# Altium schematic sheet Sheet2_datciki.SchDoc
size 420 x 297 mm; Address1: Address1; Address2: Address2; Address3: Address3; Address4: Address4; SheetNumber: 1; Scale: 1:1; Обозначение документа: АБВГ.123456.001 Э3
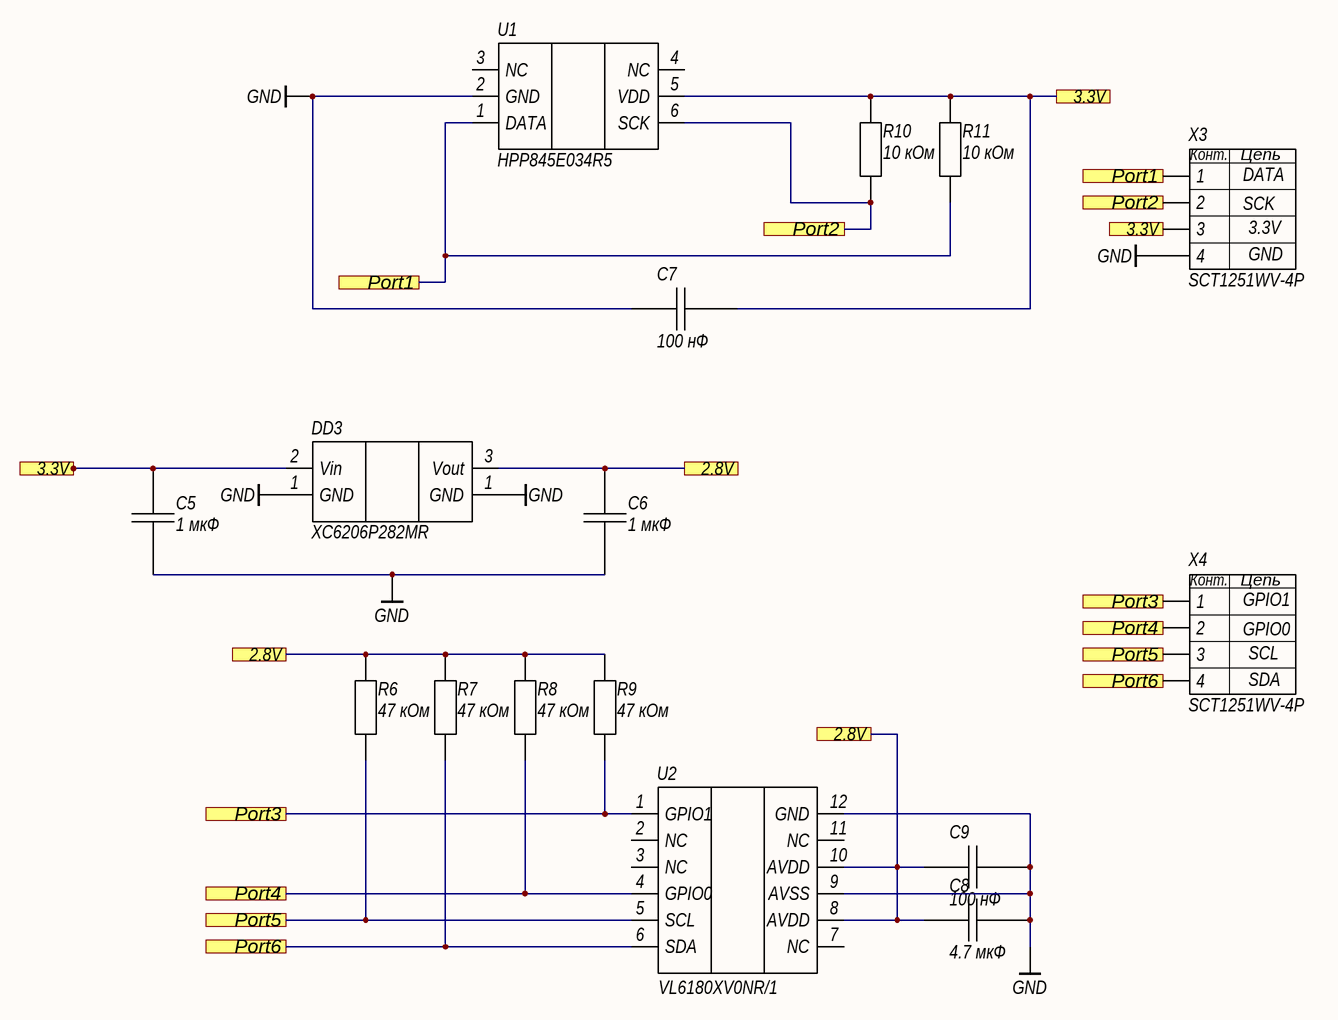
[diagram p0: Sheet2_datciki.SchDoc]

## Parts
C5  1 мкФ  [CAP_0805]
C6  1 мкФ  [CAP_0805]
C7  100 нФ  [CAP_0805]
C8  4.7 мкФ  [CAP_0805]
C9  100 нФ  [CAP_0805]
DD3  XC6206P282MR  [SOT-23-3_STAB_POWER]
R6  47 кОм  [RES_0603]
R7  47 кОм  [RES_0603]
R8  47 кОм  [RES_0603]
R9  47 кОм  [RES_0603]
R10  10 кОм  [RES_0603]
R11  10 кОм  [RES_0603]
U1  HPP845E034R5  [HTU20D(F)]
U2  VL6180XV0NR/1  [SOP12]
X3  SCT1251WV-4P  [Raziem4(1)_1.25mm]
X4  SCT1251WV-4P  [Raziem4(1)_1.25mm]

## Ports
2.8V, 3.3V, Port1, Port2, Port3, Port4, Port5, Port6

## Nets
GND: C5.2 C6.2 C7.1 C8.2 C9.2 DD3.1(GND) U1.2(GND) U2.9(AVSS) U2.12(GND) X3.4
2.8V: C6.1 C8.1 C9.1 DD3.3(Vout) R6.2 R7.2 R8.2 R9.2 U2.8(AVDD) U2.10(AVDD) ; port 2.8V
3.3V: C5.1 C7.2 DD3.2(Vin) R10.2 R11.2 U1.5(VDD) X3.3 ; port 3.3V
Port1: R11.1 U1.1(DATA) X3.1 ; port Port1
Port2: R10.1 U1.6(SCK) X3.2 ; port Port2
Port3: R9.1 U2.1(GPIO1) X4.1 ; port Port3
Port4: R8.1 U2.4(GPIO0) X4.2 ; port Port4
Port5: R6.1 U2.5(SCL) X4.3 ; port Port5
Port6: R7.1 U2.6(SDA) X4.4 ; port Port6

Not connected (* = marked no-connect by the designer): U1 3(NC) 4(NC); U2 2(NC) 3(NC) 7(NC) 11(NC)

## Notes on the sheet
- Подп. и дата
- Инв. № дубл.
- Взам. инв. №
- Инв. № подл.
- Изм.
- Лист
- № докум.
- Подп.
- Дата
- Копировал
- Формат А3
- (in symbol Raziem_4KONTKTA) Конт.; Цепь; GPIO1; GPIO0; SCL; SDA
- (in symbol Raziem_4KONTKTA_1) Конт.; Цепь; DATA; SCK; 3.3V; GND

## Library data of the parts
C5-C9 = Condensator
  C5 C6: Value: 1 мкФ
  C7 C9: Value: 100 нФ
  C8: Value: 4.7 мкФ
DD3 = Stability_power: Name: XC6206P282MR
R6-R11 = Rezistor
  R6-R9: Value: 47 кОм
  R10 R11: Value: 10 кОм
U1 = Datchik_vlaj_temp: Name: HPP845E034R5
U2 = Datchik_osvet: Name: VL6180XV0NR/1
X3 = Raziem_4KONTKTA_1: Name: SCT1251WV-4P
X4 = Raziem_4KONTKTA: Name: SCT1251WV-4P